# EAGLE schematic Threeno Tx Rev1B (EAGLE 9.6.2)
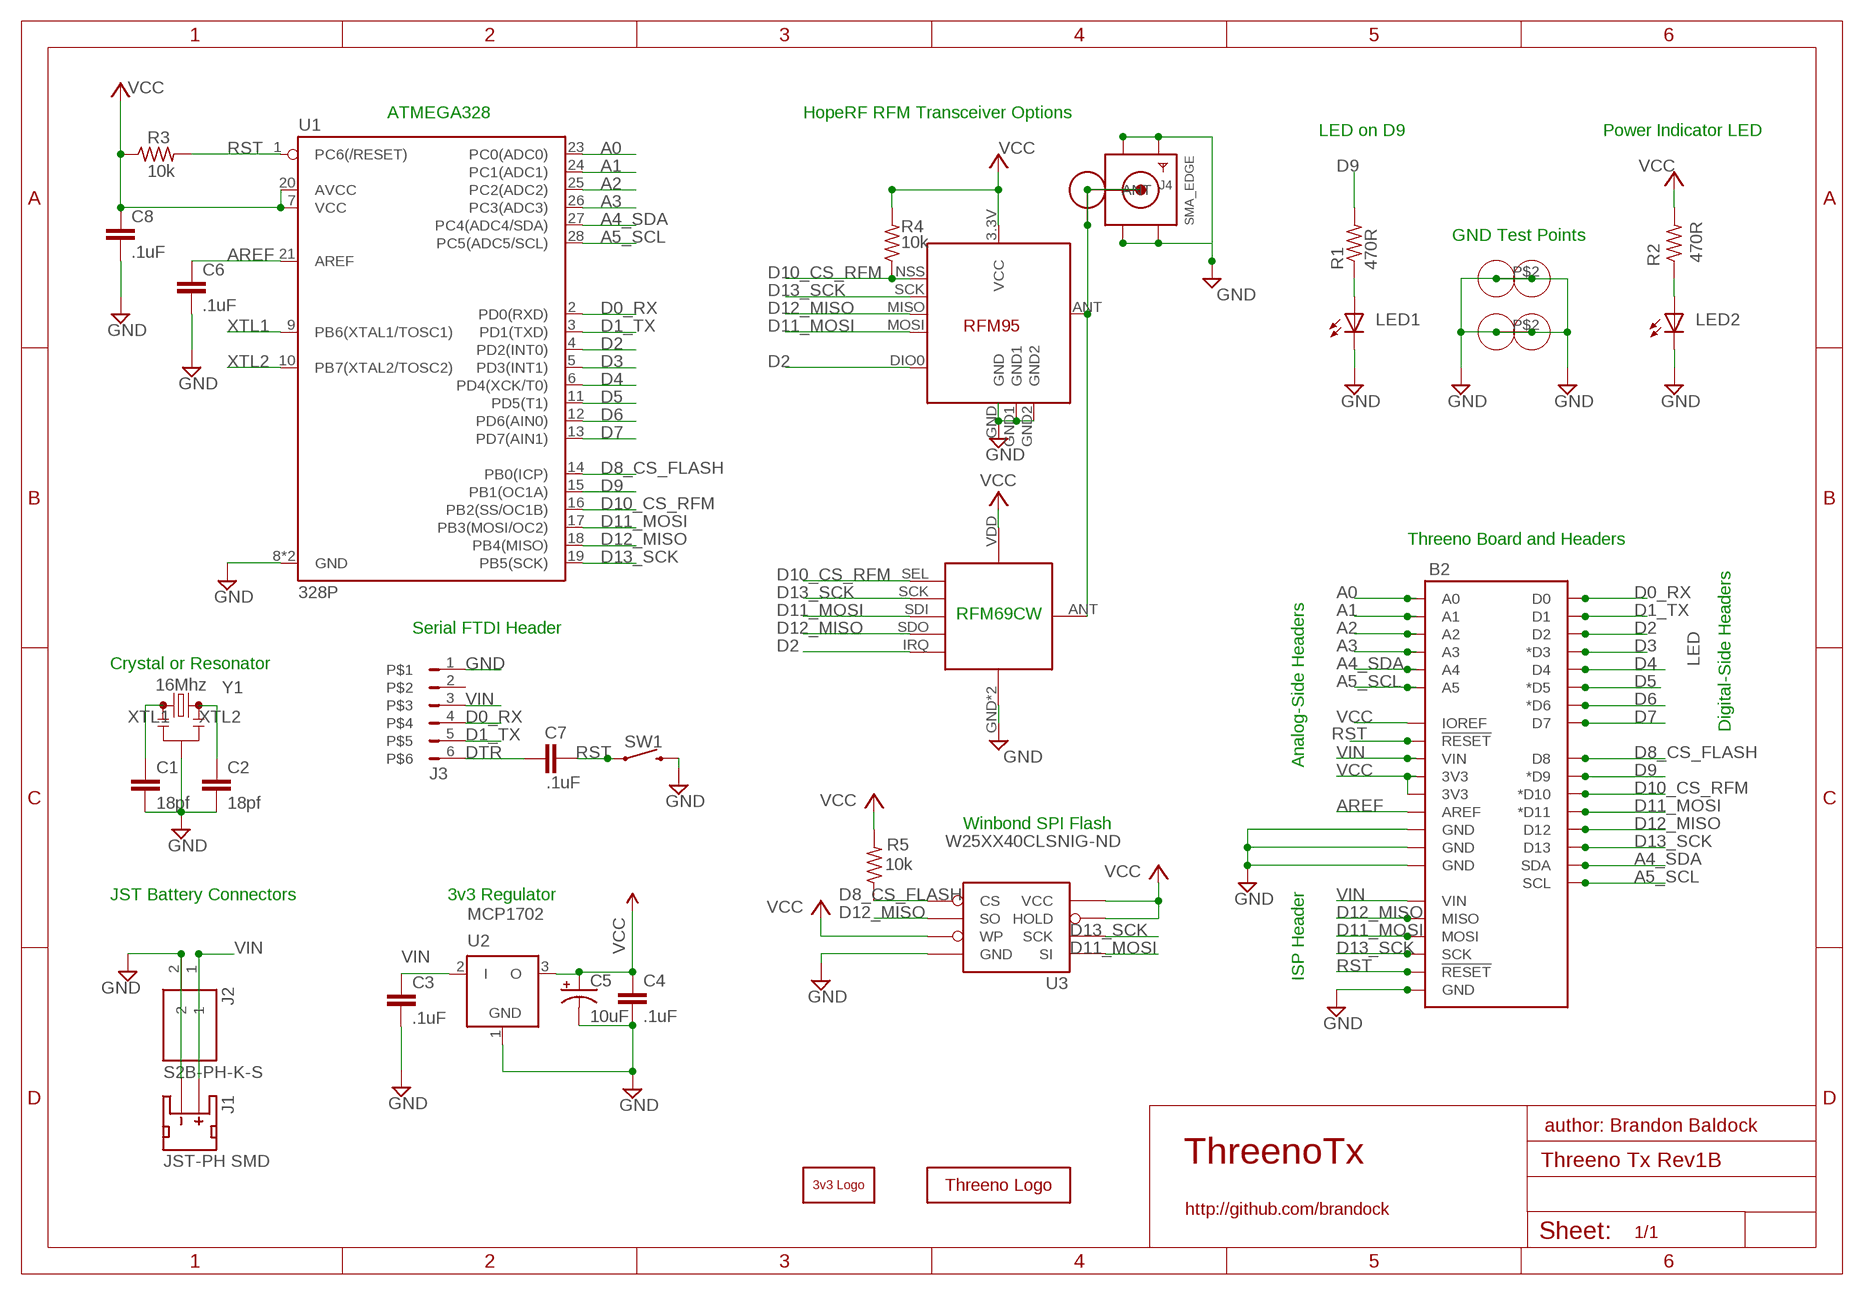
[diagram p0: schematic, sheet 1]

## Parts
B1  3VTHREENO_BOTTOM_SILK  [3VTHREENO_BOTTOM_SILK]
B2  THREENO_TX_BOARD3VTHREENO  [THREENO_TX_BOARD]
B3  3VTHREENO_LOGO  [3VTHREENO_LOGO]
C1  18pf  C-EU025-024X044-NO_MIDDLE_SILK  [C025-024X044-NO-MIDDLE-SILK]
C2  18pf  C-EU025-024X044-NO_MIDDLE_SILK  [C025-024X044-NO-MIDDLE-SILK]
C3  .1uF  C-EU025-024X044-NO_MIDDLE_SILK  [C025-024X044-NO-MIDDLE-SILK]
C4  .1uF  C-EU025-024X044-NO_MIDDLE_SILK  [C025-024X044-NO-MIDDLE-SILK]
C5  10uF  CPOL-USE1.8-4  [E1,8-4]
C6  .1uF  C-EU025-024X044-NO_MIDDLE_SILK  [C025-024X044-NO-MIDDLE-SILK]
C7  .1uF  C-EU025-024X044-NO_MIDDLE_SILK  [C025-024X044-NO-MIDDLE-SILK]
C8  .1uF  C-EU025-024X044-NO_MIDDLE_SILK  [C025-024X044-NO-MIDDLE-SILK]
J1  JST-PH-SMD  JST_2MM_MALE  [JST-2-SMD]
J2  S2B-PH-K-S  [S2BPHKS]
J3  FTDI  [FTDI_ROUND_HEADER_SILK]
J4  SMA_EDGE  SMACONNECTOR_EDGE  [SMA_EDGELAUNCH]
J5  RFM12B_ANTENNA  [RFM12B-ANTENNA]
J6  ALLIGATORCLIP-WIRELOOP  [ALLIGATORCLIP-WIRELOOP]
J7  ALLIGATORCLIP-WIRELOOP  [ALLIGATORCLIP-WIRELOOP]
LED1  LED  LED-BRANDOCK3MM  [LED3MM-BRANDOCK]
LED2  LED  LED-BRANDOCK3MM  [LED3MM-BRANDOCK]
R1  470R  R-US_0204/7  [0204/7]
R2  470R  R-US_0204/7  [0204/7]
R3  10k  R-US_0204/7  [0204/7]
R4  10k  R-US_0204/7  [0204/7]
R5  10k  R-US_0204/7  [0204/7]
RF1  RFM12B_MINPADS  [RFM12B-MINPADS]
RF2  RFM95LONGER  [RFM95_LONGER]
SW1  MOMENTARY-SWITCH-SPST-PTH-6.0MM  [TACTILE_SWITCH_PTH_6.0MM]
U1  328P  ATMEGA328P_PDIP_DIL28  [DIP28-OVALPADS]
U2  JEELABS_MCP1702Z  [JEELABS_TO92]
U3  AT25F512BJEDEC_3.9MM  [SO08]
Y1  16Mhz  CRYSTAL-OR-RESONATOR  [HC49US-OR-RESONATOR]

## Nets
A0: B2.A0 U1.23(PC0(ADC0))
A1: B2.A1 U1.24(PC1(ADC1))
A2: B2.A2 U1.25(PC2(ADC2))
A3: B2.A3 U1.26(PC3(ADC3))
A4_SDA: B2.A4 B2.SDA U1.27(PC4(ADC4/SDA))
A5_SCL: B2.A5 B2.SCL U1.28(PC5(ADC5/SCL))
AREF: B2.AREF C6.1 U1.21(AREF)
D0_RX: B2.D0 J3.4 U1.2(PD0(RXD))
D1_TX: B2.D1 J3.5 U1.3(PD1(TXD))
D2: B2.D2 RF1.IRQ RF2.DIO0 U1.4(PD2(INT0))
D3: B2.D3(*D3) U1.5(PD3(INT1))
D4: B2.D4 U1.6(PD4(XCK/T0))
D5: B2.D5(*D5) U1.11(PD5(T1))
D6: B2.D6(*D6) U1.12(PD6(AIN0))
D7: B2.D7 U1.13(PD7(AIN1))
D8_CS_FLASH: B2.D8 R5.1 U1.14(PB0(ICP)) U3.1_CS(CS)
D9: B2.D9(*D9) R1.2 U1.15(PB1(OC1A))
D10_CS_RFM: B2.D10(*D10) R4.1 RF1.SEL RF2.NSS(SEL) U1.16(PB2(SS/OC1B))
D11_MOSI: B2.D11(*D11) B2.MOSI@ICSP(MOSI) RF1.SDI(SDI/MOSI) RF2.MOSI U1.17(PB3(MOSI/OC2)) U3.5_SI(SI)
D12_MISO: B2.D12 B2.MISO@ICSP(MISO) RF1.SDO(SDO/MISO) RF2.MISO U1.18(PB4(MISO)) U3.2_SO(SO)
D13_SCK: B2.D13 B2.SCK@ICSP(SCK) RF1.SCK RF2.SCK U1.19(PB5(SCK)) U3.6_SCK(SCK)
DTR: C7.1 J3.6
GND [power]: B2.GND@1(GND) B2.GND@2(GND) B2.GND@3(GND) B2.GND@ICSP(GND) C1.2 C2.2 C3.2 C4.2 C5.- C6.2 C8.2 J1.1(-) J2.2 J3.1 J4.GND@1(GND4) J4.GND@2(GND3) J4.GND@3(GND2) J4.GND@4(GND1) J6.P$1 J6.P$2 J7.P$1 J7.P$2 LED1.K(C) LED2.K(C) RF1.GND RF1.GND2(GND) RF2.GND RF2.GND1 RF2.GND2 SW1.3 U1.8(GND) U1.22(GND) U2.1(GND) U3.4_GND(GND) Y1.2
N$2: LED2.A R2.1
N$3: J4.P(ANT) J5.P$1 RF1.ANT RF2.ANT
N$14: LED1.A R1.1
RST: B2.RESET@1(!RESET!) B2.RESET@ICSP(!RESET!) C7.2 R3.2 SW1.1 U1.1(PC6(/RESET))
VCC: B2.3.3V(3V3) B2.3.3V@2(3V3) B2.IOREF C4.1 C5.+ C8.1 R2.2 R3.1 R4.2 R5.2 RF1.VDD RF2.3.3V(VCC) U1.7(VCC) U1.20(AVCC) U2.3(O) U3.3_WP(WP) U3.7_HOLD(HOLD) U3.8_VCC(VCC) ; supply symbol labelled 3.3V
VIN: B2.VIN B2.VIN@ICSP(VIN) C3.1 J1.2(+) J2.1 J3.3 U2.2(I)
XTL1: C1.1 U1.9(PB6(XTAL1/TOSC1)) Y1.1
XTL2: C2.1 U1.10(PB7(XTAL2/TOSC2)) Y1.3
Unconnected: J1.NC1(PAD1) J1.NC2(PAD2) J3.2

## Notes on the sheet
- ATMEGA328 | HopeRF RFM Transceiver Options
- LED on D9 | Power Indicator LED
- GND Test Points
- Threeno Board and Headers
- RFM69CW
- Serial FTDI Header
- Crystal or Resonator
- Digital-Side Headers
- Analog-Side Headers
- Winbond SPI Flash
- JST Battery Connectors | 3v3 Regulator
- ISP Header
- S2B-PH-K-S
- author: Brandon Baldock
- JST-PH SMD | ThreenoTx
- http://github.com/brandock

## Library data of the parts
B1 = 3VThreeno:3VTHREENO_BOTTOM_SILK: Arduino R3 Footprint with SPI header Arduino Uno R3 Compatible Footprint. Matches PCB size of the original board. SparkFun Products: SAMD21 Dev Breakout <https://www.sparkfun.com/products/13672> RedBoard <https://www.sparkfun.com/products/12757> R3 Stackable Headers <https://www.sparkfun.com/products/11417>
B2 = 3VThreeno:THREENO_TX_BOARD: Arduino R3 Footprint with SPI header Arduino Uno R3 Compatible Footprint. Matches PCB size of the original board. SparkFun Products: SAMD21 Dev Breakout <https://www.sparkfun.com/products/13672> RedBoard <https://www.sparkfun.com/products/12757> R3 Stackable Headers <https://www.sparkfun.com/products/11417>
B3 = 3VThreeno:3VTHREENO_LOGO: Arduino R3 Footprint with SPI header Arduino Uno R3 Compatible Footprint. Matches PCB size of the original board. SparkFun Products: SAMD21 Dev Breakout <https://www.sparkfun.com/products/13672> RedBoard <https://www.sparkfun.com/products/12757> R3 Stackable Headers <https://www.sparkfun.com/products/11417>
C1-C4 C6-C8 = rcl-brandock:C-EU: CAPACITOR, European symbol
C5 = rcl:CPOL-US: POLARIZED CAPACITOR, American symbol; SPICEPREFIX: C
J1 = SparkFun-Connectors:JST_2MM_MALE: JST 2MM MALE RA CONNECTOR Two pin, compact surface mount connector. Commonly used as a battery input connection point. We really like the solid locking feeling and high current rating on these small connectors. We use these all the time as battery connectors. Mates to single-cell LiPo batteries. Here is the connector we sell at SparkFun: JST Right Angle Connector - White <https://www.sparkfun.com/products/8612> (PRT-08612) Datasheet <http://www.sparkfun.com/datasheets/Prototyping/Connectors/JST-Horizontal.pdf> It was used on these SparkFun products: SparkFun MOSFET Power Controller <https://www.sparkfun.com/products/11214> (PRT-11214) SparkFun Battery Babysitter - LiPo Battery Manager <https://www.sparkfun.com/products/13777> (PRT-13777) And many, many others that required a lipo battery connection.; PROD_ID: CONN-11443; SF_ID: PRT-08612
J2 = JST PH Thru Hole S2B-PH-K-S:S2B-PH-K-S: CONN HEADER R/A 2POS 2MM Source: Datasheet <https://media.digikey.com/pdf/Data Sheets/JST PDFs/PH Series.pdf>; DESCRIPTION: CONN HEADER R/A 2POS 2MM; HEIGHT: 4.8mm; MANUFACTURER_NAME: JST (JAPAN SOLDERLESS TERMINALS); MANUFACTURER_PART_NUMBER: S2B-PH-K-S
J3 = FTDI:FTDI: JUMPER
J4 = adafruit:SMACONNECTOR: SMA Connector 90° DIP SMA Connector, 50 Ohm (4UConnector: 07259)
J5 = LowPowerLab:RFM12B_ANTENNA
J6 J7 = Alligator Clip:ALLIGATORCLIP-WIRELOOP
LED1 LED2 = adafruit:LED-BRANDOCK: LED OSRAM: - CHIPLED LG R971, LG N971, LY N971, LG Q971, LY Q971, LO R971, LY R971 LH N974, LH R974 LS Q976, LO Q976, LY Q976 LO Q996 - Hyper CHIPLED LW Q18S LB Q993, LB Q99A, LB R99A - SideLED LS A670, LO A670, LY A670, LG A670, LP A670 LB A673, LV A673, LT A673, LW A673 LH A674 LY A675 LS A676, LA A676, LO A676, LY A676, LW A676 LS A679, LY A679, LG A679 - Hyper Micro SIDELED® LS Y876, LA Y876, LO Y876, LY Y876 LT Y87S - SmartLED LW L88C, LW L88S LB L89C, LB L89S, LG L890 LS L89K, LO L89K, LY L89K LS L896, LA L896, LO L896, LY L896 - TOPLED LS T670, LO T670, LY T670, LG T670, LP T670 LSG T670, LSP T670, LSY T670, LOP T670, LYG T670 LG T671, LOG T671, LSG T671 LB T673, LV T673, LT T673, LW T673 LH T674 LS T676, LA T676, LO T676, LY T676, LB T676, LH T676, LSB T676, LW T676 LB T67C, LV T67C, LT T67C, LS T67K, LO T67K, LY T67K, LW E67C LS E67B, LA E67B, LO E67B, LY E67B, LB E67C, LV E67C, LT E67C LW T67C LS T679, LY T679, LG T679 LS T770, LO T770, LY T770, LG T770, LP T770 LB T773, LV T773, LT T773, LW T773 LH T774 LS E675, LA E675, LY E675, LS T675 LS T776, LA T776, LO T776, LY T776, LB T776 LHGB T686 LT T68C, LB T68C - Hyper Mini TOPLED® LB M676 - Mini TOPLED Santana® LG M470 LS M47K, LO M47K, LY M47K Source: http://www.osram.convergy.de/
R1-R5 = rcl:R-US_: RESISTOR, American symbol; SPICEPREFIX: R
RF1 = RFM_MiniPads:RFM12B_MINPADS
RF2 = RFM_MiniPads:RFM95
SW1 = SparkFun-Switches:MOMENTARY-SWITCH-SPST: Momentary Switch (Pushbutton) - SPST Normally-open (NO) SPST momentary switches (buttons, pushbuttons). Variants PTH-12MM - 12mm square, through-hole Momentary Pushbutton Switch - 12mm Square <https://www.sparkfun.com/products/9190> (COM-09190) PTH-6.0MM, PTH-6.0MM-KIT - 6.0mm square, through-hole Mini Pushbutton Switch <https://www.sparkfun.com/products/97> (COM-00097) KIT package intended for soldering kit's - only one side of pads' copper is exposed. PTH-RIGHT-ANGLE-KIT - Right-angle, through-hole Right Angle Tactile Button <https://www.sparkfun.com/products/10791> - Used on SparkFun BigTime Watch Kit <https://www.sparkfun.com/products/11734> SMD-12MM - 12mm square, surface-mount Tactile Button - SMD (12mm) <https://www.sparkfun.com/products/12993> (COM-12993) Used on SparkFun PicoBoard <https://www.sparkfun.com/products/11888> SMD-4.5MM - 4.5mm Square Trackball Switch Used on SparkFun Blackberry Trackballer Breakout <https://www.sparkfun.com/products/13169> SMD-4.6MMX2.8MM - 4.60mm x 2.80mm, surface mount Used on SparkFun SAMD21 Mini Breakout <https://www.sparkfun.com/products/13664> SMD-5.2MM, SMD-5.2-REDUNDANT - 5.2mm square, surface-mount Mini Pushbutton Switch - SMD <https://www.sparkfun.com/products/8720> (COM-08720) Used on Arduino Pro Mini <https://www.sparkfun.com/products/11114> REDUNDANT package connects both switch circuits together SMD-6.0X3.5MM - 6.0 x 3.5mm, surface mount Momentary Reset Switch SMD <https://www.sparkfun.com/products/8229> (COM-08229) SMD-6.2MM-TALL - 6.2mm square, surface mount Tactile Button - SMD (6mm) <https://www.sparkfun.com/products/12992> Used on SparkFun Digital Sandbox <https://www.sparkfun.com/products/12651> SMD-RIGHT-ANGLE - Right-angle, surface mount Used on SparkFun Block for Intel® Edison - Arduino <https://www.sparkfun.com/products/13036>; PROD_ID: SWCH-08441; SF_SKU: COM-00097
U1 = SparkFun-IC-Microcontroller:ATMEGA328P_PDIP_DIL28: Atmel 328P Through hole ATMEGA328P uC used in the Arduino 32kb flash, 1k EEPROM, 2k SRAM Datasheet <http://www.sparkfun.com/datasheets/Components/SMD/ATMega328.pdf> SparkFun Products Storefront component: AVR 28 Pin 20MHz 32K 6A/D - ATMega328P <https://www.sparkfun.com/products/9061> (COM-09061) SparkFun Simon Says - Through-Hole Soldering Kit <https://www.sparkfun.com/products/10547> (KIT-10547) SparkFun Learn to Solder - Simon Says <https://www.sparkfun.com/products/13708> (KIT-13708) SparkFun BigTime Watch Kit <https://www.sparkfun.com/products/11734> (KIT-11734) SparkFun ClockIt <https://www.sparkfun.com/products/10930> (KIT-10930) SparkFun Serial Enabled LCD Kit <https://www.sparkfun.com/products/10097> (LCD-10097) SparkFun Simon Tilts - Through Hole Soldering Kit <https://www.sparkfun.com/products/12634> (KIT-12634) SparkFun Frequency Counter Kit <https://www.sparkfun.com/products/10140> (KIT-10140) FabFM Radio Kit <https://www.sparkfun.com/products/11043> (KIT-11043) SparkFun Binary Blaster Kit <https://www.sparkfun.com/products/12037> (KIT-12037) SparkFun Metro-Gnome <https://www.sparkfun.com/products/9236> (KIT-09236) ATmega328 with Arduino Optiboot (Uno) <https://www.sparkfun.com/products/10524> (DEV-10524); PROD_ID: IC-09136
U2 = JeeLib:JEELABS_MCP1702: 200 mA, Low Power Low Dropout Voltage Regulator; LDO: MCP1702
U3 = Moteino-Parts:AT25F512B: 4-Mbit SPI flash memory; FLASH_MEM: W25XX40CLSNIG-ND
Y1 = SparkFun-Clocks-Brandock:CRYSTAL-OR-RESONATOR: Crystals (Generic) These are passive quartz crystals, which can be used as a clock source for a microcontroller. Crystal's are two-terminal devices. They require external "load" capacitors to generate an oscillating signal.

## Net classes
1 power: width 0.381 mm, clearance 0.254 mm